# Altium schematic sheet W-F-FC-HX3X_.SchDoc: PCB_Project_WNDCVX1X_CONTROL_BOARD
size A3; DrawnBy: Raihan Bin Mofidul; Organization: Walton Hi-Tech Industries Ltd.; DocumentNumber: 1; Revision: 1; SheetNumber: 1
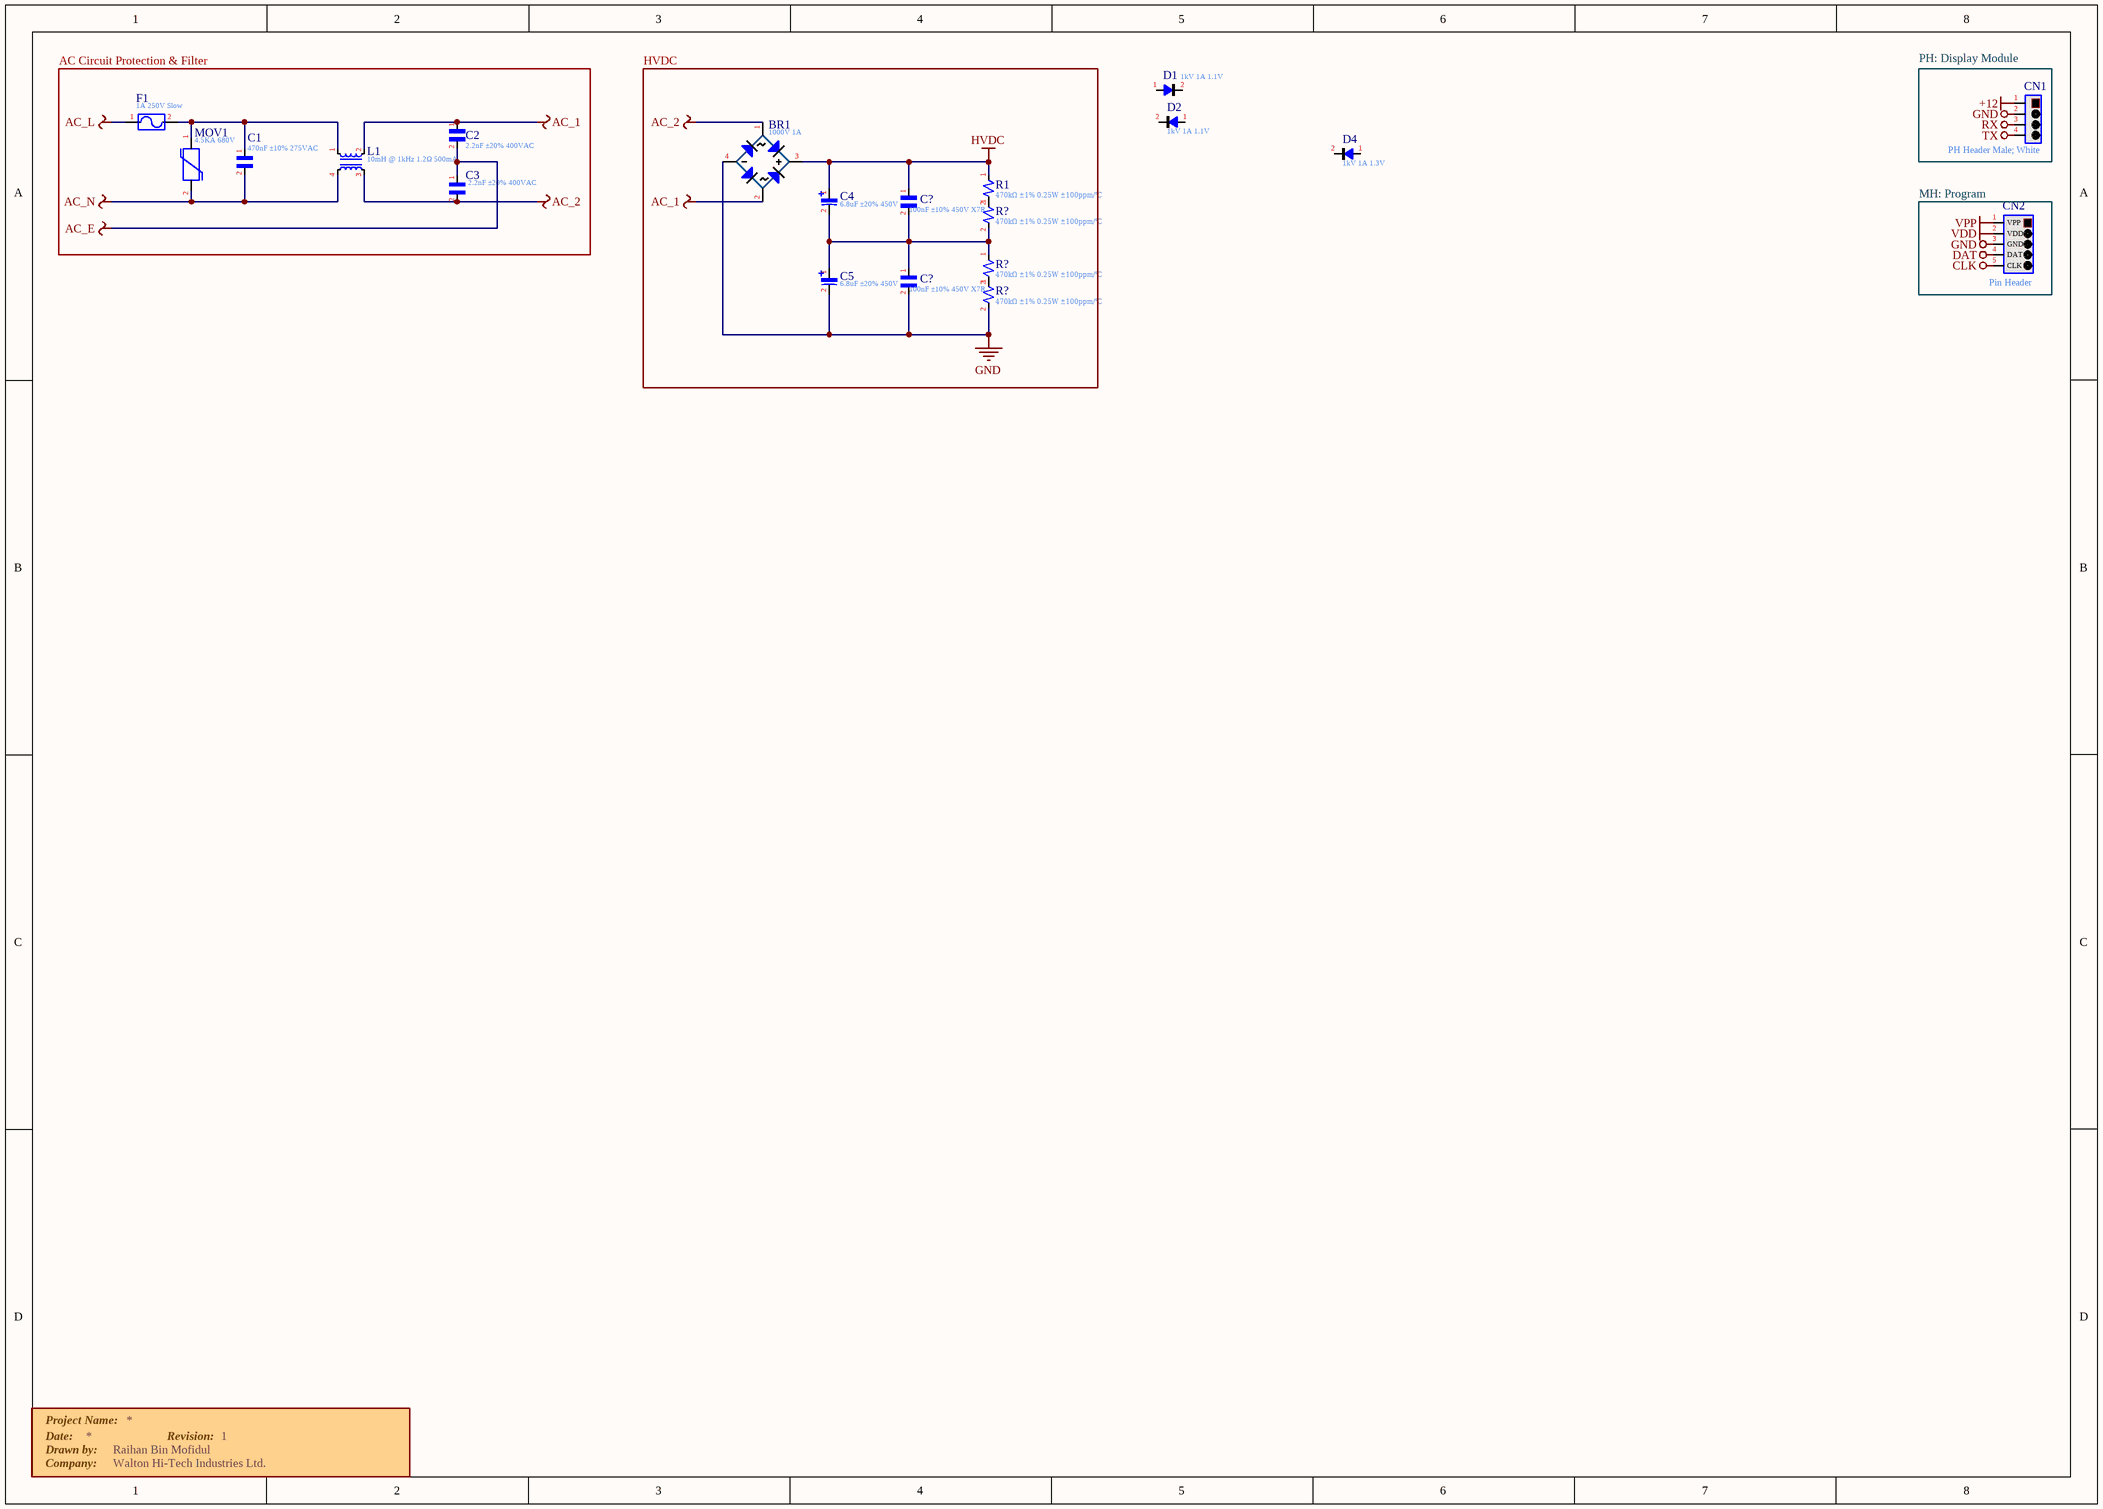
[diagram p0: W-F-FC-HX3X_.SchDoc]

## Parts
(Parts that share a designator on the sheet are numbered #1, #2 ... from top to bottom, then left to right.)
BR1  1000V 1A  [D_SMD_MBS]
C1  470nF ±10% 275VAC  [C_X2_18X10X16_P15]
C2  2.2nF ±20% 400VAC  [C_CY_P10]
C3  2.2nF ±20% 400VAC  [C_CY_P10]
C4  6.8uF ±20% 450V  [C_SMD_Ø10*13mm]
C5  6.8uF ±20% 450V  [C_SMD_Ø10*13mm]
C?#1  100nF ±10% 450V X7R  [C_1206]
C?#2  100nF ±10% 450V X7R  [C_1206]
CN1  PH Header Male; White  [CN_4P_A2001WR-S-XP-LCP]
CN2  Pin Header  [CN_PIC_MCU_Debugger_RightAngle]
D1  1kV 1A 1.1V  [D_DO-214AC]
D2  1kV 1A 1.1V  [D_DO-214AC]
D4  1kV 1A 1.3V  [D_DO-214AC]
F1  1A 250V Slow  [F_SQUARE_8.5*8_P5.08]
L1  10mH @ 1kHz 1.2Ω 500mA  [L_CMC_7x8mm]
MOV1  4.5KA 680V  [MOV_14D561K]
R1  470kΩ ±1% 0.25W ±100ppm/℃  [R_1206]
R?#1  470kΩ ±1% 0.25W ±100ppm/℃  [R_1206]
R?#2  470kΩ ±1% 0.25W ±100ppm/℃  [R_1206]
R?#3  470kΩ ±1% 0.25W ±100ppm/℃  [R_1206]

## Blocks framed on the sheet
AC Circuit Protection & Filter: C1-C3 F1 L1 MOV1
HVDC: BR1 C4 C5 C?#1 C?#2 R1 R?#1-R?#3
PH: Display Module: CN1
MH: Program: CN2

## Nets
+12: CN1.1
AC_1: BR1.2(AC) C2.1 L1.2
AC_2: BR1.1(AC) C3.2 L1.3
AC_E: C2.2 C3.1
AC_L: F1.1
AC_N: C1.2 L1.4 MOV1.2
CLK: CN2.5(CLK)
DAT: CN2.4(DAT)
GND: BR1.4(vss) C5.2 C?#2.2 CN1.2 CN2.3(GND) R?#3.2
HVDC: BR1.3(VCC) C4.1 C?#1.1 R1.1
RX: CN1.3
TX: CN1.4
VDD: CN2.2(VDD)
VPP: CN2.1(VPP)
NetC1_1: C1.1 F1.2 L1.1 MOV1.1
NetC4_2: C4.2 C5.1 C?#1.2 C?#2.1 R?#1.2 R?#2.1
NetR1_2: R1.2 R?#1.1
NetR?#2_2: R?#2.2 R?#3.1

Not connected (* = marked no-connect by the designer): D1 1(A) 2(K); D2 1(A) 2(K); D4 1(A) 2(K)

## Notes on the sheet
- Project Name:
- Date:
- Drawn by:
- Revision:
- Company:
- Title
- Size:
- A4
- Number:
- Time:
- Sheet
- of
- File:

## Library data of the parts
BR1 = Diode>> Bridge Rectifier: MB10S-10; MBS Bridge Rectifiers RoHS
C1 = Capacitor>> Non-Polar: X2P2474KQ1B0180160100ES0; Through Hole,P=15mm Suppression Capacitors RoHS
C2 C3 = Capacitor>> Non-Polar: CY1222ME1IEF46X0A2; Through Hole,P=10mm Suppression Capacitors RoHS
C4 C5 = Capacitor>> Polar: VKME1302W6R8MV; 10x13mm Aluminum Electrolytic Capacitors - SMD RoHS
C?#1 C?#2 = Capacitor>> Non-Polar: NM1206B104K451CEGN; 1206 Multilayer Ceramic Capacitors MLCC - SMD/SMT RoHS
CN1 = Connector>> 4Pins: A2001WR-S-4P; Pin 0.079"(2.00mm) 4 SMD,P=2mm Wire To Board / Wire To Wire Connector RoHS
CN2 = Connector>> PIC Program: A2541WR-5P/MTB125-1105R1/PZ254R-11-05P ;5pins, right-angle 90degrees 2.54mm Through Hole,P=2.54mm Pin Header & Female Header RoHS
D1 D2 = Diode>> General Purpose: MDD  M7; SMA(DO-214AC) Diodes - General Purpose RoHS
D4 = Diode>> General Purpose: LGE RS1M; 1A 500ns SMA Diodes - Rectifiers - Fast Recovery RoHS
F1 = Fuse: Littelfuse 39211000440; TE5 Fuse, Time-Lag type, 250V rated, designed in accordance to IEC  60127-3.
L1 = Inductor>> Common Choke
MOV1 = Varistor: VDR-14D681K; 560V 1120V 4.5KA 680V Through Hole,P=7.5MM Varistors RoHS
R1 R?#1-R?#3 = Resistor>> General Purpose: RK73H2BTTD4703F; 1206 Chip Resistor - Surface Mount RoHS